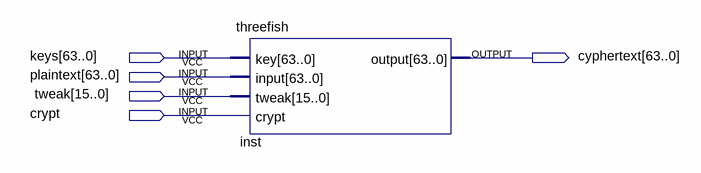
[diagram p0: schematic sheet]
// Quartus schematic 3fish.bdf as structural Verilog: 1 symbols, 5 pins
module \3fish  (
  input  [63:0] keys,
  input  [63:0] plaintext,
  input  [15:0] tweak,
  input  crypt,
  output [63:0] cyphertext
);

  threefish inst (.key(keys), .\input (plaintext), .tweak(tweak), .crypt(crypt), .\output (cyphertext));
endmodule
